# Altium schematic sheet AutoDownload.SchDoc
size A4; SheetNumber: 2; SheetTotal: 3
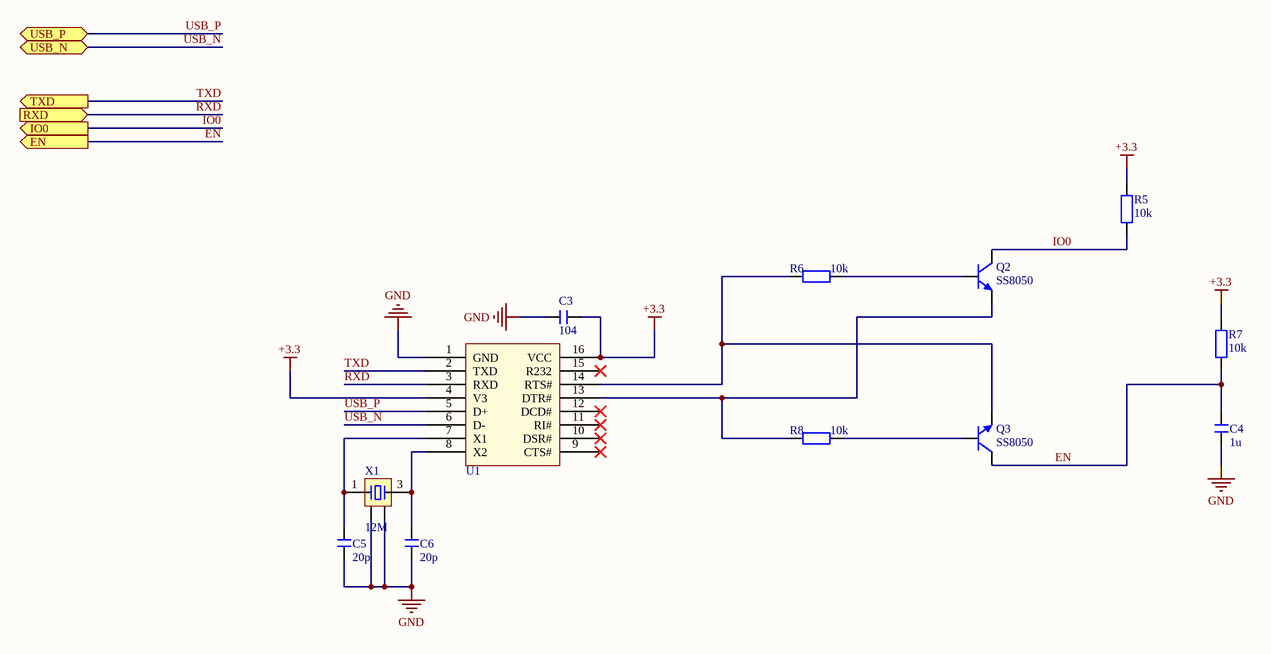
[diagram p0: AutoDownload.SchDoc]

## Parts
C3  104  [C 0603-L]
C4  1u  [C 0603-L]
C5  20p  [C 0603-L]
C6  20p  [C 0603-L]
Q2  SS8050  [SOT23-3N]
Q3  SS8050  [SOT23-3N]
R5  10k  [R 0603_L]
R6  10k  [R 0603_L]
R7  10k  [R 0603_L]
R8  10k  [R 0603_L]
U1  CH340G  [sop16_L]  (value not drawn)
X1  12M  [OSC 3225-4P]

## Ports
EN (out), IO0 (out), RXD (in), TXD (out), USB_N (bidir), USB_P (bidir)

## Nets
+3.3: C3.2 R5.2 R7.2 U1.4(V3) U1.16(VCC)
GND: C3.1 C4.1 C5.1 C6.1 U1.1(GND) X1.2 X1.4
EN: C4.2 Q3.3(C) R7.1 ; port EN
IO0: Q2.3(C) R5.1 ; port IO0
RXD: U1.3(RXD) ; port RXD
TXD: U1.2(TXD) ; port TXD
USB_N: U1.6(D-) ; port USB_N
USB_P: U1.5(D+) ; port USB_P
NetC5_2: C5.2 U1.7(X1) X1.1
NetC6_2: C6.2 U1.8(X2) X1.3
NetQ2_1: Q2.1(B) R6.2
NetQ2_2: Q2.2(E) R8.1 U1.13(DTR#)
NetQ3_1: Q3.1(B) R8.2
NetQ3_2: Q3.2(E) R6.1 U1.14(RTS#)

Not connected (* = marked no-connect by the designer): U1 9(CTS#)* 10(DSR#)* 11(RI#)* 12(DCD#)* 15(R232)*

## Library data of the parts
C3-C6 = C: 贴片电容; BOM名称: 无极性贴片电容; 优秀评价可免费更新: 联系淘宝ID：黄晶宝石，获取更新版封装库; 本封装库来自淘宝卖家 ID：黄晶宝石: 其他店铺购入均为盗版，请立即申请退款; 联系卖家，免费查找封装: 唯一出售店铺网址https://shop463601444.taobao.com
Q2 Q3 = 8050-SMD: 高频放大-NPN型; 属性: 40V 1.5A 1W 100MHZ; 卖家免费技术支持，联系售后: 唯一出售店铺网址https://shop463601444.taobao.com; 封装库来自淘宝卖家 ID：黄晶宝石: 其他店铺购入均为假冒，请立即申请退款，本店奖励2~5元现金; BOM名称: 高频放大-NPN型; 卖家免费查找封装，联系售后: 唯一出售店铺网址https://shop463601444.taobao.com
R5-R8 = R: 贴片电阻; 优秀评价可免费更新: 联系淘宝ID：黄晶宝石，获取更新版封装库; 本封装库来自淘宝卖家 ID：黄晶宝石: 其他店铺购入均为盗版，请立即申请退款; 联系卖家，免费查找封装: 唯一出售店铺网址https://shop463601444.taobao.com; BOM名称: 贴片电阻
U1 = CH340G: 优秀评价可免费更新: 联系淘宝ID：黄晶宝石，获取更新版封装库; 卖家免费技术支持，联系售后: 唯一出售店铺网址https://shop463601444.taobao.com; 封装库文件来自淘宝卖家 ID：黄晶宝石: 其他店铺购入均为盗版，请申请退款，本店提供现金奖励
X1 = XTAL-4P: 4脚无源晶振; 版权归属: 封装库来自淘宝卖家 ID：黄晶宝石; 优秀评价可免费更新: 联系淘宝ID：黄晶宝石，获取更新版封装库; 卖家免费技术支持，联系售后: 唯一出售店铺网址https://shop463601444.taobao.com; 封装库来自淘宝卖家 ID：黄晶宝石: 其他店铺购入均为盗版，请立即申请退款; BOM名称: 4脚无源晶振